# EAGLE schematic LEDDriverSFE002 (EAGLE 6.2)
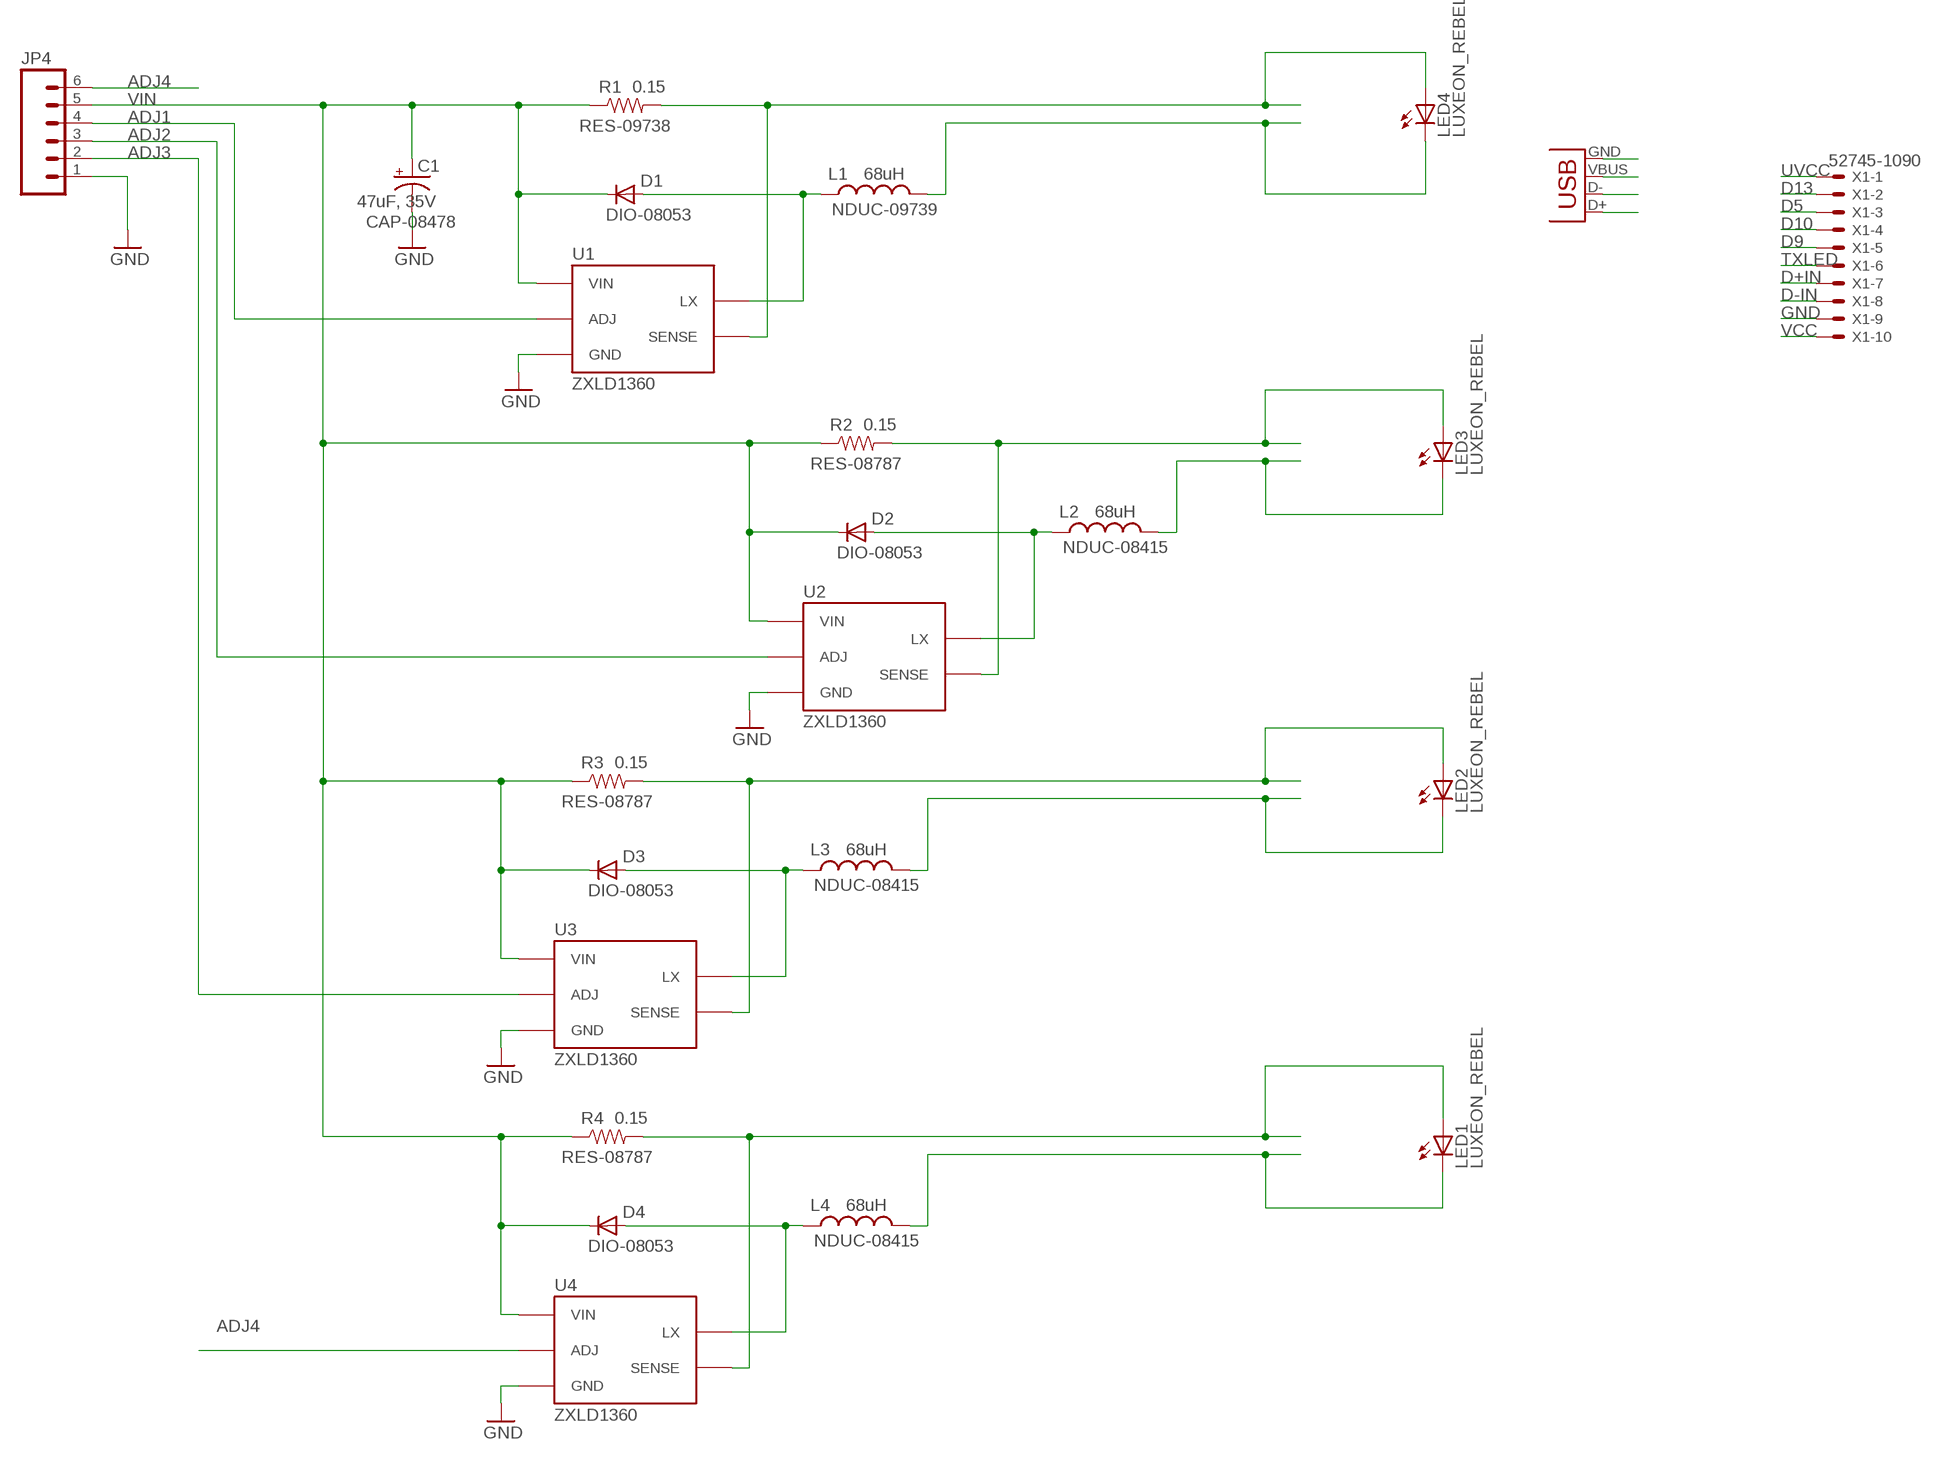
[diagram p0: schematic, sheet 1]

## Parts
C1  47uF, 35V  CAP_POLD  [PANASONIC_D]
D1  MBRA140  DIODESMA  [SMA-DIODE]
D2  MBRA140  DIODESMA  [SMA-DIODE]
D3  MBRA140  DIODESMA  [SMA-DIODE]
D4  MBRA140  DIODESMA  [SMA-DIODE]
JP4  M06SIP  [1X06]
L1  68uH  INDUCTORCR75  [CR75]
L2  68uH  INDUCTORCR75  [CR75]
L3  68uH  INDUCTORCR75  [CR75]
L4  68uH  INDUCTORCR75  [CR75]
LED1  LUXEON_REBEL  [LUXEON_REBEL]
LED2  LUXEON_REBEL  [LUXEON_REBEL]
LED3  LUXEON_REBEL  [LUXEON_REBEL]
LED4  LUXEON_REBEL  [LUXEON_REBEL]
R1  0.15  RESISTOR0603-RES  [0603-RES]
R2  0.15  RESISTOR0603-RES  [0603-RES]
R3  0.15  RESISTOR0603-RES  [0603-RES]
R4  0.15  RESISTOR0603-RES  [0603-RES]
U1  ZXLD1360  [SOT23-5]
U2  ZXLD1360  [SOT23-5]
U3  ZXLD1360  [SOT23-5]
U4  ZXLD1360  [SOT23-5]
X1  52745-1090  [52745-1090]
X2  USB-MICROB  [USB-MICROB]

## Nets
ADJ1: JP4.4 U1.3(ADJ)
ADJ2: JP4.3 U2.3(ADJ)
ADJ3: JP4.2 U3.3(ADJ)
ADJ4: JP4.6 U4.3(ADJ)
D5: X1.3
D9: X1.5
D10: X1.4
D13: X1.2
D+IN: X1.7 X2.D+
D-IN: X1.8 X2.D-
GND: C1.- JP4.1 U1.2(GND) U2.2(GND) U3.2(GND) U4.2(GND) X1.9 X2.GND
N$1: L1.P$2 LED4.C LED4.C@1(C)
N$2: D2.A L2.P$1 U2.1(LX)
N$3: LED3.A LED3.A@1(A) R2.2 U2.4(SENSE)
N$4: D1.A L1.P$1 U1.1(LX)
N$5: LED4.A LED4.A@1(A) R1.2 U1.4(SENSE)
N$6: L2.P$2 LED3.C LED3.C@1(C)
N$7: D3.A L3.P$1 U3.1(LX)
N$8: LED2.A LED2.A@1(A) R3.2 U3.4(SENSE)
N$9: L3.P$2 LED2.C LED2.C@1(C)
N$11: D4.A L4.P$1 U4.1(LX)
N$12: LED1.A LED1.A@1(A) R4.2 U4.4(SENSE)
N$13: L4.P$2 LED1.C LED1.C@1(C)
TXLED: X1.6
UVCC: X1.1 X2.VBUS
VCC: X1.10
VIN: C1.+ D1.C D2.C D3.C D4.C JP4.5 R1.1 R2.1 R3.1 R4.1 U1.5(VIN) U2.5(VIN) U3.5(VIN) U4.5(VIN)
Unconnected: LED1.TH LED1.TH@1(TH) LED1.TH@2(TH) LED1.TH@3(TH) LED1.TH@4(TH) LED2.TH LED2.TH@1(TH) LED2.TH@2(TH) LED2.TH@3(TH) LED2.TH@4(TH) LED3.TH LED3.TH@1(TH) LED3.TH@2(TH) LED3.TH@3(TH) LED3.TH@4(TH) LED4.TH LED4.TH@1(TH) LED4.TH@2(TH) LED4.TH@3(TH) LED4.TH@4(TH)

## Notes on the sheet
- RES-09738
- DIO-08053
- NDUC-09739
- CAP-08478
- RES-08787
- DIO-08053
- NDUC-08415
- RES-08787
- DIO-08053
- NDUC-08415
- RES-08787
- DIO-08053
- NDUC-08415

## Library data of the parts
C1 = SparkFun:CAP_POL: Capacitor Polarized These are standard SMD and PTH capacitors. Normally 10uF, 47uF, and 100uF in electrolytic and tantalum varieties. Always verify the external diameter of the through hole cap, it varies with capacity, voltage, and manufacturer. The EIA devices should be standard.
D1-D4 = SparkFun:DIODE: Diode These are standard reverse protection diodes and small signal diodes. SMA package can handle up to about 1A. SOD-323 can handle about 200mA. What the SOD-323 package when ordering, there are some mfgs out there that are 5-pin packages.
JP4 = SparkFun-Connectors:M06: Header 6 Standard 6-pin 0.1" header. Use with straight break away headers (SKU : PRT-00116), right angle break away headers (PRT-00553), swiss pins (PRT-00743), machine pins (PRT-00117), and female headers (PRT-00115). Molex polarized connector foot print use with SKU : PRT-08094 with associated crimp pins and housings. NOTES ON THE VARIANTS LOCK and LOCK_LONGPADS... This footprint was designed to help hold the alignment of a through-hole component (i.e. 6-pin header) while soldering it into place. You may notice that each hole has been shifted either up or down by 0.005 of an inch from it's more standard position (which is a perfectly straight line). This slight alteration caused the pins (the squares in the middle) to touch the edges of the holes. Because they are alternating, it causes a "brace" to hold the component in place. 0.005 has proven to be the perfect amount of "off-center" position when using our standard breakaway headers. Although looks a little odd when you look at the bare footprint, once you have a header in there, the alteration is very hard to notice. Also, if you push a header all the way into place, it is covered up entirely on the bottom side. This idea of altering the position of holes to aid alignment will be further integrated into the Sparkfun Library for other footprints. It can help hold any component with 3 or more connection pins.
L1-L4 = SparkFun:INDUCTOR: Inductors Basic Inductor/Choke - 0603 and 1206. Footprints are not proven and vary greatly between part numbers.
LED1-LED4 = led:LUXEON_REBEL: LUXEON Rebel Display layer 93, Pins, and connect all contact points with a net. The thermal pads are defined in a separate gate with addlevel REQUEST. Draw a net named 'TH' and connect all thermal pads with it. Please read the Package's Description about DRC settings. Source: http://www.lumileds.com/pdfs/AB32.pdf
R1-R4 = SparkFun:RESISTOR: Resistor Basic schematic elements and footprints for 0603, 1206, and PTH 1/10th watt (small) resistors.
U1-U4 = SparkFun:ZXLD1360: Adjustable constant current switching driver for high-power LEDs
X1 = con-molex:52745-1090: FFC/FPC-to-Board 0.50mm (.020") SMT Top Contact Right Angle, ZIF, Style Receptacle 52745 / 52435 Source: http://www.molex.com/product/ffc/52745.html; MPN: 52745-1090; OC_FARNELL: unknown; OC_NEWARK: 92M6380
X2 = SparkFun-Connectors:USB: USB Connectors USB-B-PTH is fully proven SKU : PRT-00139 USB-miniB is fully proven SKU : PRT-00587 USB-A-PCB is untested. USB-A-H is throughly reviewed, but untested. Spark Fun Electronics SKU : PRT-00437 USB-B-SMT is throughly reviewed, but untested. Needs silkscreen touching up. USB-A-S has not been used/tested USB-MB-H has not been used/tested